# Altium schematic sheet Fan_control.SchDoc
size 297 x 209 mm; Author: MMr; DocumentNumber: 1; SheetNumber: 1; SheetTotal: 2
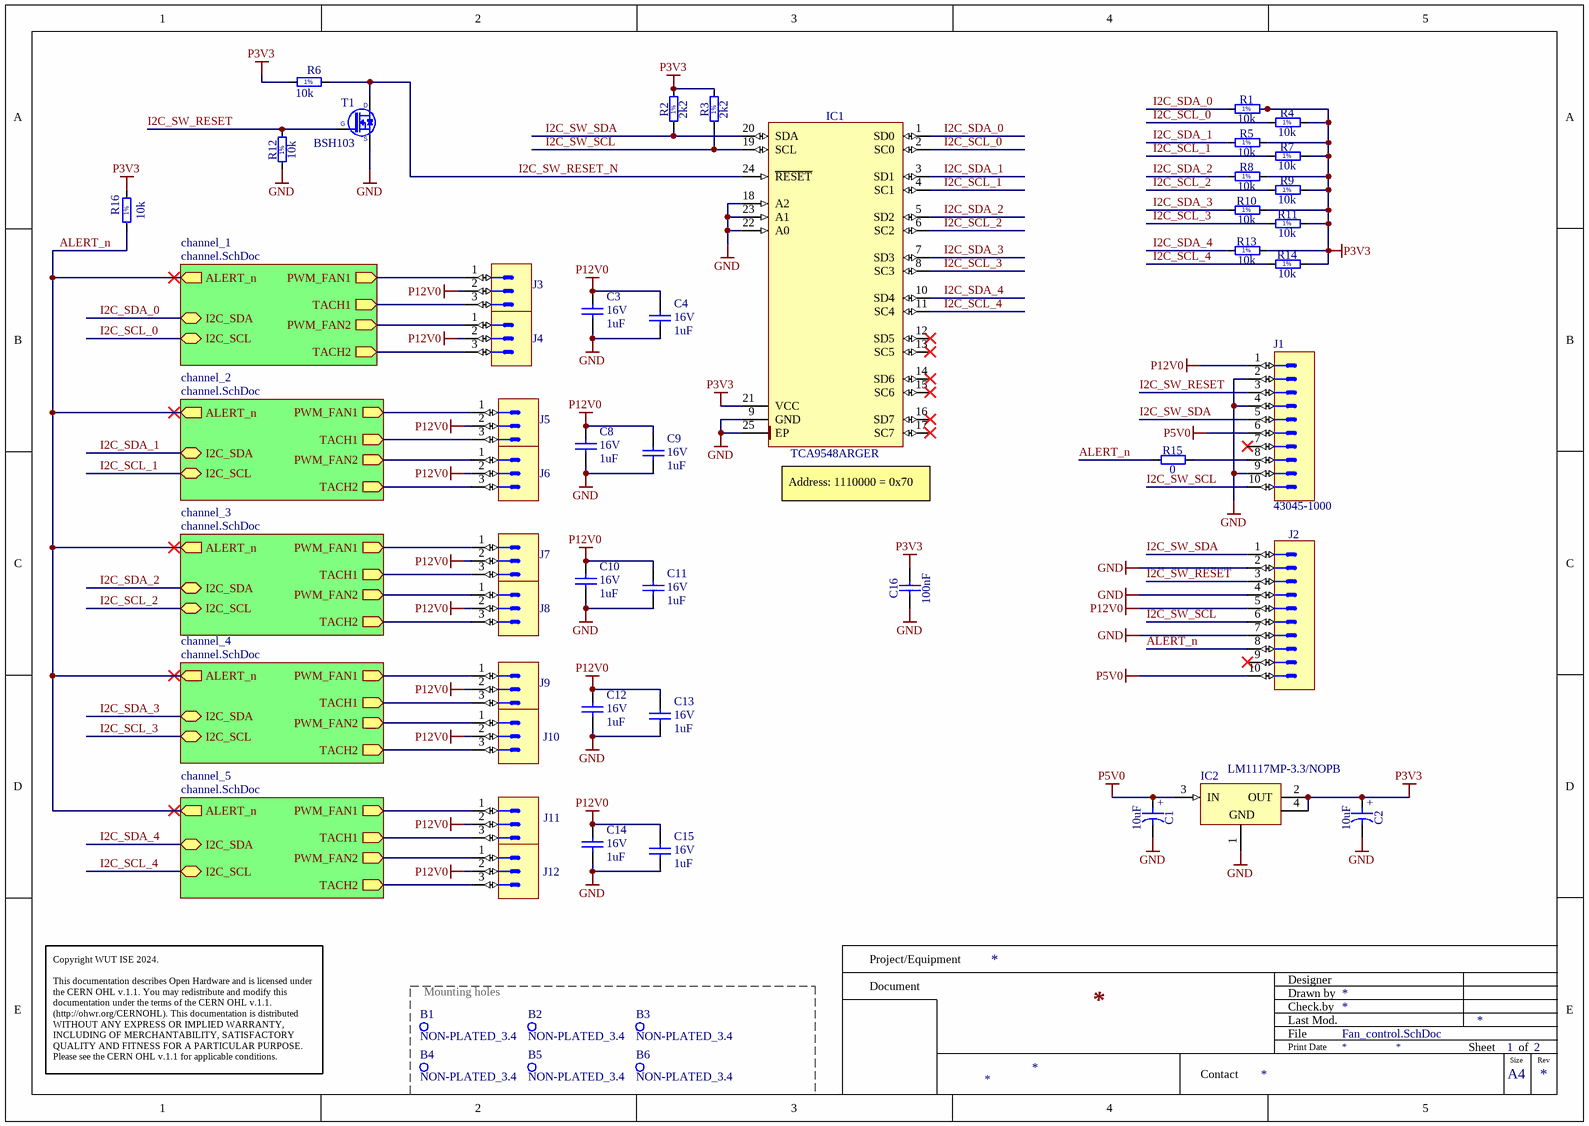
[diagram p0: Fan_control.SchDoc]

## Parts
B1  NON-PLATED_3.4  [MTG340]  (no BOM)
B2  NON-PLATED_3.4  [MTG340]  (no BOM)
B3  NON-PLATED_3.4  [MTG340]  (no BOM)
B4  NON-PLATED_3.4  [MTG340]  (no BOM)
B5  NON-PLATED_3.4  [MTG340]  (no BOM)
B6  NON-PLATED_3.4  [MTG340]  (no BOM)
C1  10uF  [CAPMP3216X180N]
C2  10uF  [CAPMP3216X180N]
C3  1uF  Voltage: 16V  [CAPC1608X87N]
C4  1uF  Voltage: 16V  [CAPC1608X87N]
C8  1uF  Voltage: 16V  [CAPC1608X87N]
C9  1uF  Voltage: 16V  [CAPC1608X87N]
C10  1uF  Voltage: 16V  [CAPC1608X87N]
C11  1uF  Voltage: 16V  [CAPC1608X87N]
C12  1uF  Voltage: 16V  [CAPC1608X87N]
C13  1uF  Voltage: 16V  [CAPC1608X87N]
C14  1uF  Voltage: 16V  [CAPC1608X87N]
C15  1uF  Voltage: 16V  [CAPC1608X87N]
C16  100nF  [CAPC1005X55N]
IC1  TCA9548ARGER  [QFN50P400X400X100-25N-S220]
IC2  LM1117MP-3.3/NOPB  [SOT230P700X180-4N]
J1  43045-1000  [43045-1000]
J2  Header 10  [3M_N2510-5002RB]  (value not drawn)
J3  KK®  [MOLEX_22-05-7038]  (value not drawn)
J4  KK®  [MOLEX_22-05-7038]  (value not drawn)
J5  KK®  [MOLEX_22-05-7038]  (value not drawn)
J6  KK®  [MOLEX_22-05-7038]  (value not drawn)
J7  KK®  [MOLEX_22-05-7038]  (value not drawn)
J8  KK®  [MOLEX_22-05-7038]  (value not drawn)
J9  KK®  [MOLEX_22-05-7038]  (value not drawn)
J10  KK®  [MOLEX_22-05-7038]  (value not drawn)
J11  KK®  [MOLEX_22-05-7038]  (value not drawn)
J12  KK®  [MOLEX_22-05-7038]  (value not drawn)
R1  10k  [RESC1005X40N]
R2  2k2  [RESC1005X40N]
R3  2k2  [RESC1005X40N]
R4  10k  [RESC1005X40N]
R5  10k  [RESC1005X40N]
R6  10k  [RESC1005X40N]
R7  10k  [RESC1005X40N]
R8  10k  [RESC1005X40N]
R9  10k  [RESC1005X40N]
R10  10k  [RESC1005X40N]
R11  10k  [RESC1005X40N]
R12  10k  [RESC1005X40N]
R13  10k  [RESC1005X40N]
R14  10k  [RESC1005X40N]
R15  0  [RESC1005X40N]
R16  10k  [RESC1005X40N]
T1  BSH103  [SOT95P230X110-3N]

## Sub-sheets
channel_1 = channel.SchDoc: I2C_SCL (bidir), I2C_SDA (bidir), ALERT_n (out), PWM_FAN1 (out), PWM_FAN2 (out), TACH1 (out), TACH2 (out)
channel_2 = channel.SchDoc: I2C_SCL (bidir), I2C_SDA (bidir), ALERT_n (out), PWM_FAN1 (out), TACH1 (out), PWM_FAN2 (out), TACH2 (out)
channel_3 = channel.SchDoc: I2C_SCL (bidir), I2C_SDA (bidir), ALERT_n (out), PWM_FAN1 (out), PWM_FAN2 (out), TACH1 (out), TACH2 (out)
channel_4 = channel.SchDoc: I2C_SCL (bidir), I2C_SDA (bidir), ALERT_n (out), PWM_FAN1 (out), PWM_FAN2 (out), TACH1 (out), TACH2 (out)
channel_5 = channel.SchDoc: I2C_SCL (bidir), I2C_SDA (bidir), ALERT_n (out), PWM_FAN1 (out), PWM_FAN2 (out), TACH1 (out), TACH2 (out)

## Nets
GND: C1.2 C2.2 C3.1 C4.1 C8.1 C9.1 C10.1 C11.1 C12.1 C13.1 C14.1 C15.1 C16.1 IC1.9(GND) IC1.18(A2) IC1.22(A0) IC1.23(A1) IC1.25(EP) IC2.1(GND) J1.2 J1.4 J1.9 J2.2 J2.4 J2.7 R12.1 T1.2(S)
P3V3: C2.1 C16.2 IC1.21(VCC) IC2.2(OUT) IC2.4 R1.2 R2.2 R3.2 R4.2 R5.2 R6.1 R7.2 R8.2 R9.2 R10.2 R11.2 R13.2 R14.2 R16.2
P5V0: C1.1 IC2.3(IN) J1.6 J2.10
P12V0: C3.2 C4.2 C8.2 C9.2 C10.2 C11.2 C12.2 C13.2 C14.2 C15.2 J1.1 J2.5 J3.2 J4.2 J5.2 J6.2 J7.2 J8.2 J9.2 J10.2 J11.2 J12.2
ALERT_n: J2.8 R15.1 R16.1 ; sheet channel_2/ALERT_n, sheet channel_3/ALERT_n, sheet channel_4/ALERT_n, sheet channel_5/ALERT_n, sheet channel_1/ALERT_n
I2C_SCL_0: IC1.2(SC0) R4.1 ; sheet channel_1/I2C_SCL
I2C_SCL_1: IC1.4(SC1) R7.1 ; sheet channel_2/I2C_SCL
I2C_SCL_2: IC1.6(SC2) R9.1 ; sheet channel_3/I2C_SCL
I2C_SCL_3: IC1.8(SC3) R11.1 ; sheet channel_4/I2C_SCL
I2C_SCL_4: IC1.11(SC4) R14.1 ; sheet channel_5/I2C_SCL
I2C_SDA_0: IC1.1(SD0) R1.1 ; sheet channel_1/I2C_SDA
I2C_SDA_1: IC1.3(SD1) R5.1 ; sheet channel_2/I2C_SDA
I2C_SDA_2: IC1.5(SD2) R8.1 ; sheet channel_3/I2C_SDA
I2C_SDA_3: IC1.7(SD3) R10.1 ; sheet channel_4/I2C_SDA
I2C_SDA_4: IC1.10(SD4) R13.1 ; sheet channel_5/I2C_SDA
I2C_SW_RESET: J1.3 J2.3 R12.2 T1.1(G)
I2C_SW_RESET_N: IC1.24(~{RESET}) R6.2 T1.3(D)
I2C_SW_SCL: IC1.19(SCL) J1.10 J2.6 R3.1
I2C_SW_SDA: IC1.20(SDA) J1.5 J2.1 R2.1
NetJ1_8: J1.8 R15.2
NetJ3_1: J3.1 ; sheet channel_1/PWM_FAN1
NetJ3_3: J3.3 ; sheet channel_1/TACH1
NetJ4_1: J4.1 ; sheet channel_1/PWM_FAN2
NetJ4_3: J4.3 ; sheet channel_1/TACH2
NetJ5_1: J5.1 ; sheet channel_2/PWM_FAN1
NetJ5_3: J5.3 ; sheet channel_2/TACH1
NetJ6_1: J6.1 ; sheet channel_2/PWM_FAN2
NetJ6_3: J6.3 ; sheet channel_2/TACH2
NetJ7_1: J7.1 ; sheet channel_3/PWM_FAN1
NetJ7_3: J7.3 ; sheet channel_3/TACH1
NetJ8_1: J8.1 ; sheet channel_3/PWM_FAN2
NetJ8_3: J8.3 ; sheet channel_3/TACH2
NetJ9_1: J9.1 ; sheet channel_4/PWM_FAN1
NetJ9_3: J9.3 ; sheet channel_4/TACH1
NetJ10_1: J10.1 ; sheet channel_4/PWM_FAN2
NetJ10_3: J10.3 ; sheet channel_4/TACH2
NetJ11_1: J11.1 ; sheet channel_5/PWM_FAN1
NetJ11_3: J11.3 ; sheet channel_5/TACH1
NetJ12_1: J12.1 ; sheet channel_5/PWM_FAN2
NetJ12_3: J12.3 ; sheet channel_5/TACH2

Not connected (* = marked no-connect by the designer): B1 1; B2 1; B3 1; B4 1; B5 1; B6 1; IC1 12(SD5)* 13(SC5)* 14(SD6)* 15(SC6)* 16(SD7)* 17(SC7)*; J1 7*; J2 9*

## Notes on the sheet
- (near IC1) Address: 1110000 = 0x70
- Mounting holes
- Project/Equipment
- Document
- Designer
- Drawn by
- Check.by
- Last Mod.
- Copyright WUT ISE 2024.
  This documentation describes Open Hardware and is licensed under the CERN OHL v.1.1. You may redistribute and modify this documentation under the terms of the CERN OHL v.1.1. (http://ohwr.org/CERNOHL). This documentation is distributed WITHOUT ANY EXPRESS OR IMPLIED WARRANTY, INCLUDING OF MERCHANTABILITY, SATISFACTORY QUALITY AND FITNESS FOR A PARTICULAR PURPOSE. Please see the CERN OHL v.1.1 for applicable conditions.
- Contact
- File
- Print Date
- Sheet
- Size
- A4
- of
- Rev
- (in symbol CTE3216-18_10UF_16V_20%_AVX_TCJ) +
- (in symbol R0402_2K2_1%_0.0625W_100PPM) 1%
- (in symbol R0402_10K_1%_0.0625W_100PPM) 1%

## Library data of the parts
B1-B6 = CMP-00028-00013-2: Non Plated hole with diameter 3.4MM for screw M3
C1 C2 = CTE3216-18_10UF_16V_20%_AVX_TCJ: Polarised capacitor; Part Description: ESR 0R200 Tantalum Solid Electrolytic Chip Capacitor with Conductive Polymer Electrode; Manufacturer: AVX; Manufacturer Part Number: TCJA106M016R0200; Voltage: 16V; Tolerance: ±20%; Part Number: CTE3216-18_10UF_16V_20%_AVX_TCJ; Component Kind: Standard; Component Type: Standard; Pin Count: 2; Value: 10uF; Status: Preferred; Case: A; Mounted: Yes; Socket: No; SMD: Yes; Sense: No; ComponentHeight: 1.8mm; HelpURL: \\cern.ch\dfs\Applications\Altium\Datasheets\CTE_AVX_TCJ.pdf; Author: CERN DEM JLC; CreateDate: 29.03.2012; LatestRevisionDate: 29.03.2012
C3 C4 C8-C15 = CC0603_1UF_16V_10%_X7R: Non-polarised capacitor; Part Description: SMD Multilayer Chip Ceramic Capacitor; Manufacturer: GENERIC; Manufacturer1 Part Number: 223878615663; TC: X7R; Tolerance: ±10%; Part Number: CC0603_1UF_16V_10%_X7R; Component Kind: Standard; Component Type: Standard; Pin Count: 2; Value: 1uF; Status: None; Manufacturer Part Number: CC0603_1UF_16V_10%_X7R; Case: 0603; Mounted: Yes; Socket: No; SMD: Yes; Manufacturer1 Example: YAGEO PHYCOMP; Manufacturer1 ComponentHeight: 0.9mm; HelpURL: \\cern.ch\dfs\Applications\Altium\Datasheets\CC0603_X7R_PHYCOMP.pdf; Author: CERN DEM JLC; CreateDate: 03.12.2007; LatestRevisionDate: 17.04.2015; Sense: No
C16 = CC0402_100NF_16V_10%_X7R: Non-polarised capacitor; Part Description: SMD Multilayer Chip Ceramic Capacitor; Manufacturer: GENERIC; Manufacturer1 Part Number: GRM155R71C104KA88D; Voltage: 16V; TC: X7R; Tolerance: ±10%; Part Number: CC0402_100NF_16V_10%_X7R; Component Kind: Standard; Component Type: Standard; Pin Count: 2; Value: 100nF; Status: Not Recommended; Manufacturer Part Number: CC0402_100NF_16V_10%_X7R; Case: 0402; Mounted: Yes; Socket: No; SMD: Yes; Sense: No; Manufacturer1 Example: MURATA; Manufacturer1 ComponentHeight: 0.55mm; HelpURL: \\cern.ch\dfs\Applications\Altium\Datasheets\CC0402_X7R_MURATA_GRM.pdf; Author: CERN DEM JLC; CreateDate: 05/12/2013; LatestRevisionDate: 03/12/2007
IC1 = TCA9548ARGER: Low Voltage 8-Channel I2C Switch With Reset; Manufacturer: TEXAS INSTRUMENTS; PressFit: No; Bonding: No; Part Number: TCA9548ARGER; Component Kind: Standard; Component Type: Standard; Device: TCA9548ARGER; PackageDescription: QFN, 0.50mm Pitch, Square; 24 Pin, 4.00mm L X 4.00mm W X 1.00mm H body (w/thermal tab 2.2 X 2.2mm), IPC Medium Density; Part Description: Low Voltage 8-Channel I2C Switch With Reset; Manufacturer Part Number: TCA9548ARGER; Pin Count: 25; Case: QFN24; Mounted: Yes; Socket: No; SMD: Yes; Sense: No; ComponentHeight: 1mm; Author: CERN DEM JLC; HelpURL: \\cern.ch\dfs\Applications\Altium\Datasheets\TCA9548ARGER.pdf; CreateDate: 07.07.2014; LatestRevisionDate: 07.07.2014
IC2 = LM1117MP-3.3/NOPB: 3-Terminal Regulator 1=GND 2=OUT 3=IN 4=OUT; Device: LM1117MP-3.3/NOPB; Part Number: LM1117MP-3.3/NOPB
J1 = CMP-002-04656-3: Rectangular Power Connector, 10 Contact(s), Male, Solder Terminal, Receptacle; Connector Type: Power,Rectangular; Min Operating Temperature: -40°C; Mounting Technology: Board; Max Operating Temperature: 105°C; RoHS Compliant: Yes
J2 = 3M_N2510-5002RB: Connector 10 Male; Part Description: 10 Contacts, Right Angle .100" x .100" Low Profile Four-Wall Header, (Solder Tail 2.84mm), 2500 Series; Manufacturer: 3M; PressFit: No; Part Number: 3M_N2510-5002RB; Component Kind: Standard; Component Type: Standard; Pin Count: 10; Family: Header 10; Mounted: Yes; Socket: No; SMD: No; Sense: No; Status: None; Manufacturer Part Number: N2510-5002RB; ComponentHeight: 8.59mm; HelpURL: \\cern.ch\dfs\Applications\Altium\Datasheets\3M_N2510-5002RB.pdf; Author: CERN DEM JLC; CreateDate: 29.10.2008; LatestRevisionDate: 27.10.2022
J3-J12 = MOLEX_22-05-7038: Connector 3 Male; Part Description: 2.54mm (.100") Pitch KK® Wire-To-Board Header, Right Angle, with Friction Lock, 3 Circuits; Manufacturer: MOLEX; PressFit: No; Part Number: MOLEX_22-05-7038; Component Kind: Standard; Component Type: Standard; Pin Count: 3; Family: KK®; Mounted: Yes; Socket: No; SMD: No; Sense: No; Status: None; Manufacturer Part Number: 22-05-7038; ComponentHeight: 5.8mm; HelpURL: \\cern.ch\dfs\Applications\Altium\Datasheets\MOLEX_22-05-7038.pdf; Author: CERN DEM JLC; CreateDate: 19.09.2012; LatestRevisionDate: 19.09.2012
R1 R4-R14 R16 = R0402_10K_1%_0.0625W_100PPM: Resistor - 1%; Part Description: General Purpose Thick Film Chip Resistor; Manufacturer: GENERIC; Manufacturer1 Part Number: 232270671003L; TC: ±100ppm/°C; PressFit: No; Part Number: R0402_10K_1%_0.0625W_100PPM; Component Kind: Standard; Component Type: Standard; Pin Count: 2; Value: 10k; Status: Not Recommended; Power: 0.0625W; Tolerance: ±1%; Manufacturer Part Number: R0402_10K_1%_0.0625W_100PPM; Case: 0402; Mounted: Yes; Sense: No; Socket: No; SMD: Yes; Manufacturer1 Example: YAGEO PHYCOMP; Manufacturer1 ComponentHeight: 0.4mm; HelpURL: \\cern.ch\dfs\Applications\Altium\Datasheets\R0402_Phycomp_RC0402.pdf; Author: CERN DEM JLC; CreateDate: 03.12.2007; LatestRevisionDate: 17.10.2012
R2 R3 = R0402_2K2_1%_0.0625W_100PPM: Resistor - 1%; Part Description: General Purpose Thick Film Chip Resistor; Manufacturer: GENERIC; Manufacturer1 Part Number: 232270672202L; TC: ±100ppm/°C; PressFit: No; Part Number: R0402_2K2_1%_0.0625W_100PPM; Component Kind: Standard; Component Type: Standard; Pin Count: 2; Value: 2k2; Status: Not Recommended; Power: 0.0625W; Tolerance: ±1%; Manufacturer Part Number: R0402_2K2_1%_0.0625W_100PPM; Case: 0402; Mounted: Yes; Sense: No; Socket: No; SMD: Yes; Manufacturer1 Example: YAGEO PHYCOMP; Manufacturer1 ComponentHeight: 0.4mm; HelpURL: \\cern.ch\dfs\Applications\Altium\Datasheets\R0402_Phycomp_RC0402.pdf; Author: CERN DEM JLC; CreateDate: 03.12.2007; LatestRevisionDate: 17.10.2012
R15 = R0402_0R_JUMPER: Resistor; Part Description: 1A (0.05R Max DC Resistance) Zero Ohm Jumper; Manufacturer: GENERIC; Manufacturer1 Part Number: 232270591001L; PressFit: No; Part Number: R0402_0R_JUMPER; Component Kind: Standard; Component Type: Standard; Pin Count: 2; Value: 0; Status: Not Recommended; Manufacturer Part Number: R0402_0R_JUMPER; Case: 0402; Mounted: Yes; Sense: No; Socket: No; SMD: Yes; Manufacturer1 Example: YAGEO PHYCOMP; Manufacturer1 ComponentHeight: 0.4mm; HelpURL: \\cern.ch\dfs\Applications\Altium\Datasheets\R0402_Phycomp_RC0402.pdf; Author: CERN DEM JLC; CreateDate: 03.12.2007; LatestRevisionDate: 17.10.2012
T1 = BSH103: N-CHANNEL MOSFET WITH DIODE; Part Description: 30V 850mA N-Channel Enhancement Mode Field-Effect Transistor; Manufacturer: NEXPERIA; PressFit: No; Bonding: No; Part Number: BSH103; Component Kind: Standard; Component Type: Standard; Device: BSH103; PackageDescription: SOT23, 3 pin, Pitch 0.95mm - 1.3mm W X 2.9mm L X 1.1mm H, IPC Medium Density; Manufacturer Part Number: BSH103; Pin Count: 3; Case: SOT23-3; Mounted: Yes; Socket: No; SMD: Yes; Sense: No; ComponentHeight: 1.1mm; HelpURL: \\cern.ch\dfs\Applications\Altium\Datasheets\BSH103.pdf; Author: CERN DEM JLC; CreateDate: 16.03.2010; LatestRevisionDate: 20.06.2017; ClassName: Artix